# EAGLE design slaveMeteo (EAGLE 8.2.2)

## Sheet 1 of 2
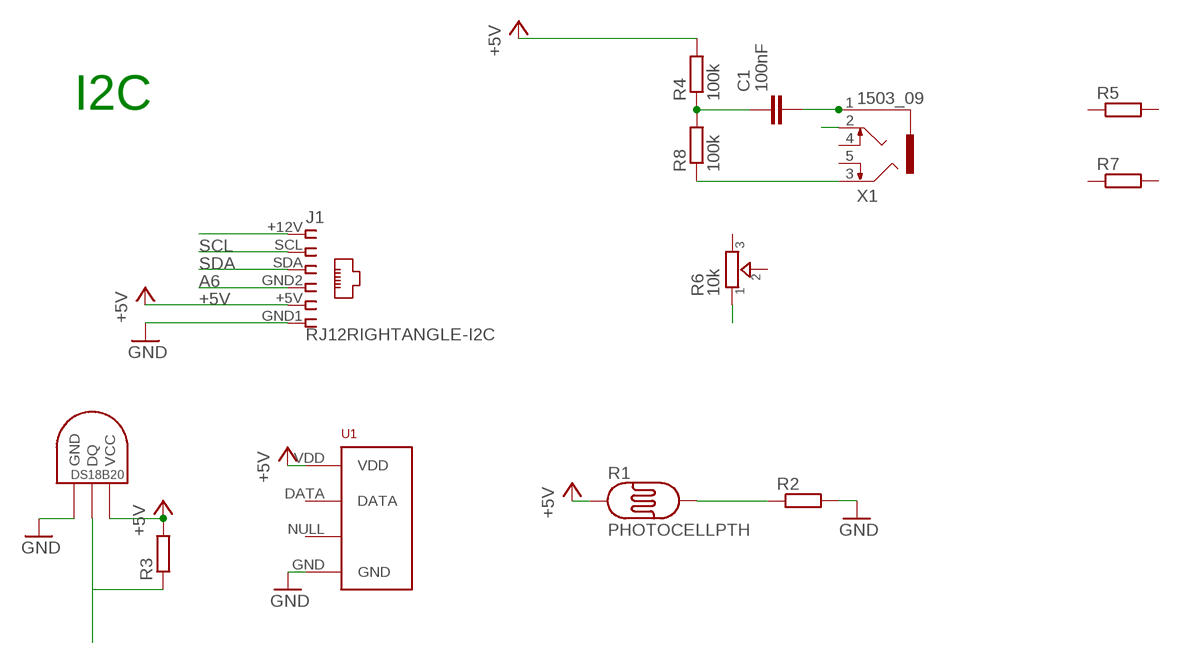
[diagram p0: schematic, sheet 1]

### Parts
C1  100nF  CAPACITOR_NPOL-0805  [C805]
J1  RJ12RIGHTANGLE-I2C  [RJ12-RIGHTANGLE-I2C]
R1  PHOTOCELLPTH  [PHOTOCELL]
R2  R-EU_R0805  [R0805]
R3  R-EU_R0805  [R0805]
R4  100k  R-EU_R0805  [R0805]
R5  R-EU_R0805  [R0805]
R6  10k  TRIMMER-3362P  [TRIMMER_3362P]
R7  R-EU_R0805  [R0805]
R8  100k  R-EU_R0805  [R0805]
U1  RHT03_DHT-22_AM2302RA  [RHT03_DHT-22/RA]
U$1  DS1820TO92  [DS1820]
X1  1503_09  [1503_09]

### Nets
+5V: J1.+5V R1.1 R3.2 R4.2 U1.VDD U$1.VDD(VCC)
A6: J1.GND2
GND [power]: J1.GND1 R2.2 U1.GND U$1.GND ; also sheet 2
GND1 [power]: R6.1
GND2 [power]: R8.1 X1.3
N$1: R1.2 R2.1
N$3: R3.1 U$1.DQ
N$4: J1.+12V
N$5: C1.1 R4.1 R8.2
N$14 [power]: C1.2 X1.1
N$21 [power]: X1.2
SCL: J1.SCL
SDA: J1.SDA
Unconnected: R5.1 R5.2 R6.2 R6.3 R7.1 R7.2 U1.DATA U1.NULL X1.4 X1.5

### Notes on the sheet
- I2C

## Sheet 2 of 2
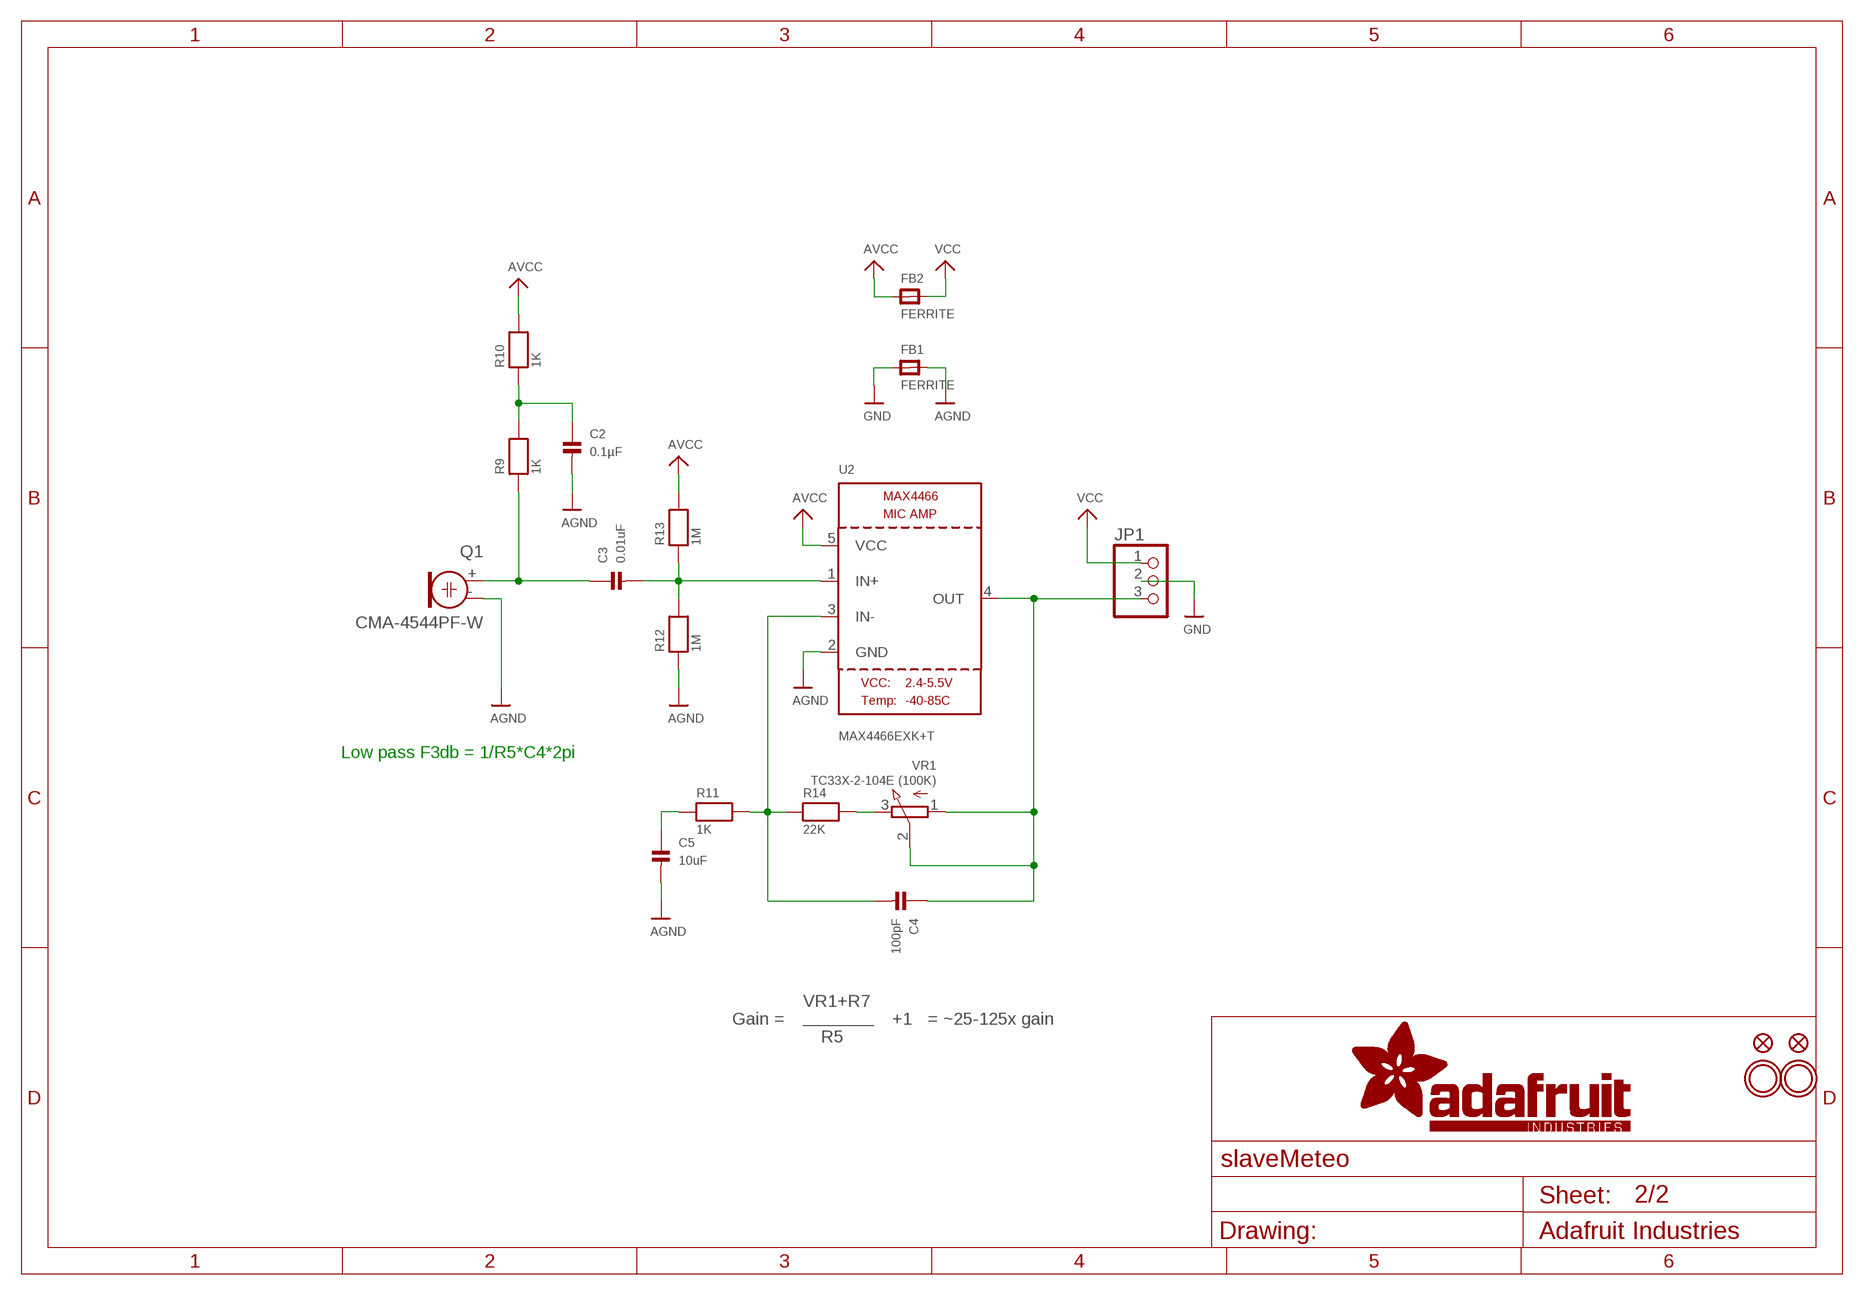
[diagram p1: schematic, sheet 2]

### Parts
C2  0.1µF  CAP_CERAMIC0805  [0805]
C3  0.01uF  CAP_CERAMIC0805  [0805]
C4  100pF  CAP_CERAMIC0805  [0805]
C5  10uF  CAP_CERAMIC0805  [0805]
FB1  FERRITE  FERRITE0805  [0805]
FB2  FERRITE  FERRITE0805  [0805]
FID1  FIDUCIAL""  [FIDUCIAL_1MM]
FID2  FIDUCIAL""  [FIDUCIAL_1MM]
JP1  HEADER-1X376MIL  [1X03_ROUND_76]
Q1  CMA-4544PF-W  ELECTRET  [ELECTRET_9.7]
R9  1K  RESISTOR0805  [0805]
R10  1K  RESISTOR0805  [0805]
R11  1K  RESISTOR0805  [0805]
R12  1M  RESISTOR0805  [0805]
R13  1M  RESISTOR0805  [0805]
R14  22K  RESISTOR0805  [0805]
U2  MAX4466EXK+T  MAX4466""  [SC70-5]
U$14  MOUNTINGHOLE2.5  [MOUNTINGHOLE_2.5_PLATED]
U$15  MOUNTINGHOLE2.5  [MOUNTINGHOLE_2.5_PLATED]
VR1  TC33X-2-104E (100K)  TRIMPOTTC33X-2  [TRIMPOT_BOURNS_TC33X-2]

### Nets
AGND: C2.2 C5.2 FB1.2 Q1.- R12.1 U2.2(GND)
AVCC: FB2.1 R10.2 R13.2 U2.5(VCC)
GND [power]: FB1.1 JP1.2 ; also sheet 1
N$2: C3.1 Q1.+ R9.1
N$6: C2.1 R9.2 R10.1
N$7: C3.2 R12.2 R13.1 U2.1(IN+)
N$8: C4.1 JP1.3 U2.4(OUT) VR1.1(A) VR1.2(S)
N$9: C4.2 R11.2 R14.1 U2.3(IN-)
N$10: C5.1 R11.1
N$11: R14.2 VR1.3(E)
VCC: FB2.2 JP1.1

### Notes on the sheet
- Low pass F3db = 1/R5*C4*2pi
- VR1+R7
- Gain = | +1 | = ~25-125x gain
- R5

## Library data of the parts
C1 = dp_devices:CAPACITOR_NPOL: Non-Polarized capacitor in various packages
C2-C5 = microbuilder:CAP_CERAMIC: Ceramic Capacitors 0402 - 0402 Surface Mount Capacitors 16pF 50V 5% [Digikey: 445-4899-2-ND] 18pF 50V 5% [Digikey: 490-1281-2-ND] 22pF 50V 5% [Digikey: 490-1283-2-ND] 68pF 50V 5% [Digikey: 490-1289-2-ND] 0.1uF 10V 10% [Digikey: 490-1318-2-ND] 1.0uF 6.3V 10% [Digikey: 490-1320-2-ND] 0603 - 0603 Surface Mount Capacitors 16 pF 50V 5% [Digikey: 445-5051-2-ND] 22 pF 50V [Digikey: PCC220ACVTR-ND] 33 pF 50V 5% [Digikey: 490-1415-1-ND] 56pF 50V 5% [Digikey: 490-1421-1-ND] 220pF 50V 5% [Digikey: 445-1285-1-ND] 680 pF 50V 2200 pF 50V 5% C0G [Digikey: 445-1297-1-ND] 5600 pF 100V 5% X7R [Digikey: 478-3711-1-ND] 0.1 µF 25V 10% [Digikey: PCC2277TR-ND] 0.22 µF 16V 10% X7R [Digikey: 445-1318-1-ND] 1.0 µF 25V 10% [Digikey: 445-5146-2-ND] 0603 - RF Specific 3pF 250V +/-0.1pF RF [Digikey: 712-1347-1-ND] 18 pF 250V 5% [Digikey: 478-3505-1-ND or 712-1322-1-ND] 56 pF 250V 5% C0G RF [Digikey: 490-4867-1-ND] 68 pF 250V RF [Digikey: 490-4868-1-ND] 0805 - 0805 Surface Mount Capacitors 220 pF 250V 2% RF Ceramic Capacitor [Digikey: 712-1398-1-ND] 1000 pF 50V 2% NP0 Ceramic Capacitor [Digikey: 478-3760-1-ND] 0.1 µF 25V 10% Ceramic Capacitor [Digikey: PCC1828TR-ND] 1.0 µF 16V 10% Ceramic Capacitor[Digikey: 490-1691-2-ND] 10.0 µF 10V 10% Ceramic Capacitor[Digikey: 709-1228-1-ND] 10.0 uF 16V 10% Ceramic Capacitor [Digikey: 478-5165-2-ND] 47 uF 6.3V 20% Ceramic Capacitor [Digikey: 587-1779-1-ND or 399-5506-1-ND] 1206 - 1206 Surface Mount Capacitors 47uF 10V 20% Ceramic Capacitor [Digikey: 490-5528-1-ND or 399-5508-1-ND or 445-6010-1-ND] 100uF 6.3V -20%, +80% Y5V Ceramic Capacitor (Digikey: 490-4512-1-ND, Mouser: 81-GRM31CF50J107ZE1L)
FB1 FB2 = microbuilder:FERRITE: Ferrite Bead 0603 MMZ1608B121C - 120 Ohm @ 100MHz, 600mA, 0.15 Ohm DC Resistance - Digikey: 445-2164-1-ND BK1608HW121-T - 120 Ohm, 600mA Ferrite Chip - Digikey: 587-1876-2-ND 0805 HZ0805B272R-10 - 2.7K Ohm @ 100MHz, 200mA, 0.8 Ohm DC Resistance - Digikey: 240-2504-1-ND (see also Murata BLM21BD272SN1L) MMZ2012Y152B - 1.5K Ohm @ 100MHz, 500mA, 0.4 Ohm DC Resistance - Digikey: 445-1560-1-ND - Mainly for high frequency (80-400MHz) MMZ2012R102A - 1K Ohm @ 100MHz, 500mA, 0.3 Ohm DC Resistance - Digikey: 445-1555-2-ND - More general purpose (10-200MHz)
FID1 FID2 = microbuilder:FIDUCIAL: Fiducial Alignment Points Various fiducial points for machine vision alignment.
J1 = lpatiny:RJ12: CORCOM Modular RJ Jacks No Shield Source: www.tycoelectronics.com .. ENG_DS_1654001_1099_RJ_L_0507.pdf
JP1 = microbuilder:HEADER-1X3: PIN HEADER
Q1 = microbuilder:ELECTRET: Electret microphone Thru hole 2.54mm spacing with 9.7mm diameter
R1 = SparkFun:PHOTOCELL: Photocell Also known as a CdS photoresistor. This is a low cost way to detect light levels. Resistance decreases with more incoming light. SparkFun SKU: SEN-09088
R2-R5 R7 R8 = resistor:R-EU_: RESISTOR, European symbol
R6 = dp_devices:TRIMMER: Trimmer resistor
R9-R14 = microbuilder:RESISTOR: Resistors 0402 - 0402 Surface Mount Package 22 Ohm 1% 1/16W [Digikey: 311-22.0LRTR-ND] 33 Ohm 5% 1/16W 1.0K 5% 1/16W 1.5K 5% 1/16W 2.0K 1% 1/16W 10.0K 1% 1/16W [Digikey: 311-10.0KLRTR-ND] 10.0K 5% 1/16W [Digikey: RMCF0402JT10K0TR-ND] 12.1K 1% 1/16W [Digikey: 311-22.0LRTR-ND] 100.0K 5% 1/16W 0603 - 0603 Surface Mount Package 0 Ohm 1/10 Watt 1% Resistor 15 Ohm 1/10 Watt 1% Resistor 33 Ohm 1/10 Watt 1% Resistor 49.9 Ohm 1/10 Watt 1% Resistor 100 Ohm 1/10 Watt 1% Resistor 150 Ohm 1/10 Watt 1% Resistor 240 Ohm 1/10 Watt 1% Resistor 390 Ohm 1/10 Watt 1% Resistor 560 Ohm 1/10 Watt 1% Resistor 680 Ohm 1/10 Watt 1% Resistor 750 Ohm 1/10 Watt 1% Resistor 1.0K Ohm 1/10 Watt 1% Resistor 1.5K Ohm 1/10 Watt 1% Resistor 2.0K Ohm 1/10 Watt 1% Resistor 2.2K Ohm 1/10 Watt 1% Resistor 3.3K Ohm 1/10 Watt 1% Resistor 4.7K Ohm 1/10 Watt 1% Resistor 10.0K Ohm 1/10 Watt 1% Resistor 12.0K Ohm 1/10 Watt 1% Resistor 12.1K Ohm 1/10 Watt 1% Resistor 20.0K Ohm 1/10 Watt 1% Resistor 33.0K Ohm 1/10 Watt 1% Resistor 100.0K Ohm 1/10 Watt 1% Resistor 0805 - 0805 Surface Mount Package 0 Ohm 1/8 Watt 1% Resistor 33 Ohm 1/8 Watt 1% Resistor 100 Ohm 1/8 Watt 1% Resistor 150 Ohm 1/8 Watt 1% Resistor 200 Ohm 1/8 Watt 1% Resistor 240 Ohm 1/8 Watt 1% Resistor 330 Ohm 1/8 Watt 1% Resistor 390 Ohm 1/8 Watt 1% Resistor 470 Ohm 1/8 Watt 1% Resistor 1.0K Ohm 1/8 Watt 1% Resistor 1.5K Ohm 1/8 Watt 1% Resistor 2.0K Ohm 1/8 Watt 1% Resistor 4.7K Ohm 1/8 Watt 1% Resistor 5.1K Ohm 1/8 Watt 1% Resistor 5.6K Ohm 1/8 Watt 1% Resistor 10.0K Ohm 1/8 Watt 1% Resistor 22.0K Ohm 1/8 Watt 1% Resistor 33.0K Ohm 1/8 Watt 1% Resistor 100K Ohm 1/8 Watt 1% Resistor 1206 - 1206 Surface Mount Package 2012 - 2010 Surface Mount Package 0.11 Ohm 1/2 Watt 1% Resistor - Digikey: RHM.11UCT-ND
U1 = RHT03_DHT-22_AM2302:RHT03_DHT-22_AM2302: RHT03 / DHT-22 / AM2302 Packages and symbol for the RHT03 / DHT-22 relative humidity and temperature sensor. Note: The AM2302 is a wired version of the DHT-22 which typically requires less clearance and is thus provided as a separate package.; PROD_ID: SEN-10167
U2 = microbuilder:MAX4466: MAX4466 - Microphone Pre-Amp
U$1 = Ava:DS1820: DS18B20 Programmable Resolution 1-Wire Digital Thermometer Description The DS18B20 digital thermometer provides 9-bit to 12-bit Celsius temperature measurements and has an alarm function with nonvolatile user-programmable upper and lower trigger points. The DS18B20 communicates over a 1-Wire® bus that by definition requires only one data line (and ground) for communication with a central microprocessor. It has an operating temperature range of -55°C to +125°C and is accurate to ±0.5°C over the range of -10°C to +85°C. In addition, the DS18B20 can derive power directly from the data line ("parasite power"), eliminating the need for an external power supply. Each DS18B20 has a unique 64-bit serial code, which allows multiple DS18B20s to function on the same 1-Wire bus. Thus, it is simple to use one microprocessor to control many DS18B20s distributed over a large area. Applications that can benefit from this feature include HVAC environmental controls, temperature monitoring systems inside buildings, equipment, or machinery, and process monitoring and control systems.
U$14 U$15 = microbuilder:MOUNTINGHOLE: Mounting Hole For #2 screws (0.086"/2.18mm width, 0.094"/2.4mm hole) use 2.5mm
VR1 = microbuilder:TRIMPOT: 3-Pin SMT Trimpots Bourns TC33 (X-2) Series 10K - Digikey: TC33X-2-103E 100K - Digikey: TC33X-104ECT-ND Bourns 3303 (W) Series 3mm 10K Single Turn - Digikey: 3303W-103ETR-ND 3mm 100K Single Turn - Digikey: 3303X-104ETR-ND
X1 = con-lumberg:1503_09: Jack connectors according to JISC 6560, 3.5 mm Klinkeneinbaukupplung nach JISC 6560, 3,5 mm, 3-polig/ stereo, abgewinkelte Ausführung, mit 2 Öffnern und Lötaugen, für Leiterplatten Rückseitenmontage Source: http://www.lumberg.com/Produkte/PDFs/1503_09.pdf; OC_FARNELL: 1243244; OC_NEWARK: unknown

## Net classes
1 power: width 0.203 mm, drill 0.305 mm, clearance 0.25 mm

## Board
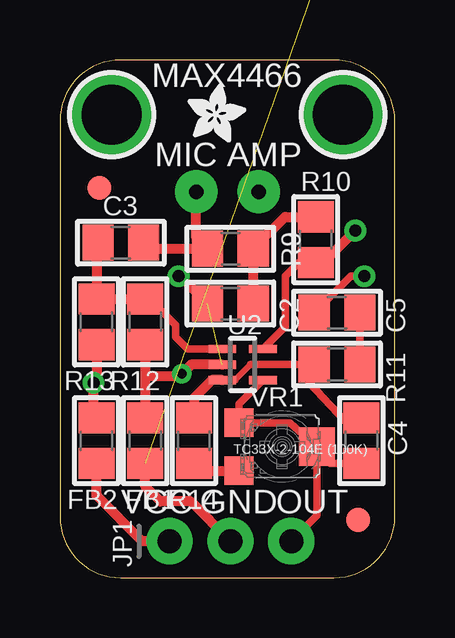
[diagram p2: board, top side]
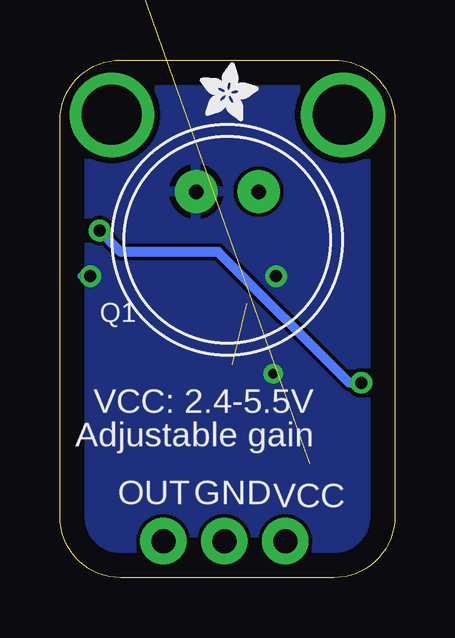
[diagram p3: board, bottom side, seen from below]

Size 13.97 x 21.59 mm. Coordinates in mm from the lower left corner, seen from the top.
Outline: 0,19.05 0,2.54 arc90 2.54,0 11.43,0 arc90 13.97,2.54 13.97,19.05 arc90 11.43,21.59 2.54,21.59 arc90 0,19.05
Copper layers (1*16): Top 0.035mm / dielectric 1.5mm / Bottom 0.035mm
Design rules "default": minimum track width 6mil, minimum drill 0.35mm, track to track 6mil, track to pad 6mil, pad to pad 6mil, via to via 6mil, smd to smd 6mil, copper to edge 40mil, drill to drill 6mil, minimum pad ring 10mil, minimum via ring 8mil, stop-mask expansion 4mil, vias tented up to drill 0mil, thermal gap 10mil

### Footprints (pad centres in the part's own frame; a part is rotated, then mirrored left to right if it is on the bottom)
C805 = smd 1.3 x 1.5: 1 -0.95,0; 2 0.95,0
0805 = smd 1.3 x 1.5: 1 -0.95,0; 2 0.95,0
FIDUCIAL_1MM = smd 1 x 1: 1 0,0
RJ12-RIGHTANGLE-I2C = drill 0.8 pad 1.3: +5V -1.54,4.84; +12V 2.54,4.84; GND1 -2.54,2.3; GND2 -0.5,2.3; SCL 1.54,2.3; SDA 0.5,4.84 | hole 2.36: -6,0; 6,0
1X03_ROUND_76 = drill 1 pad 1.93: 1 -2.54,0; 2 0,0; 3 2.54,0
ELECTRET_9.7 = drill 0.6 pad 1.778: + 1.3,2; - -1.3,2
PHOTOCELL = drill 0.8 pad 1.676: 1 -2,0; 2 2,0
R0805 = smd 1.3 x 1.5: 1 -0.95,0; 2 0.95,0
TRIMMER_3362P = drill 0.8: 1 -2.54,-0.31; 2 0,2.54; 3 2.54,-0.31
RHT03_DHT-22/RA = drill 0.8: DATA -1.27,0; GND 3.81,0; NULL 1.27,0 | drill 0.8 octagon: VDD -3.81,0 | hole 3.25: 0,24.5
SC70-5 = smd 0.35 x 1.15: 1 -0.65,-0.85; 2 0,-0.85; 3 0.65,-0.85; 4 0.65,0.85; 5 -0.65,0.85
DS1820 = drill 0.8: DQ 2.54,-1.27; GND 0.635,-1.27; VDD 4.445,-1.27
MOUNTINGHOLE_2.5_PLATED = drill 2.5 pad 3.2: P$1 0,0
TRIMPOT_BOURNS_TC33X-2 = smd 1.2 x 1.2: 1 -1,-1.8; 3 1,-1.8 | smd 1.6 x 1.5: 2 0,1.45
1503_09 = drill 0.8 pad 1.2 long: 1 0,-2.1; 2 -4.55,-5.4; 3 5.05,-9.9; 4 -4,-13.1; 5 2.65,-8.5

### Placement (x,y rotation side)
C1  2.54,50.8 0 top  (outside the outline)
C2  7.11,11.43 180 top
C3  2.54,13.97 180 top
C4  12.57,5.72 90 top
C5  11.56,11.05 180 top
FB1  3.56,5.72 90 top
FB2  1.52,5.72 270 top
FID1  12.45,2.41 0 top
FID2  1.65,16.26 0 top
J1  38.1,184.15 0 top  (outside the outline)
JP1  7.11,1.52 0 top
Q1  6.98,14.1 0 bottom
R1  11.43,128.27 0 top  (outside the outline)
R2  39.69,109.22 0 top  (outside the outline)
R3  2.54,102.87 0 top  (outside the outline)
R4  2.54,44.45 0 top  (outside the outline)
R5  2.54,38.1 0 top  (outside the outline)
R6  8.89,90.17 0 top  (outside the outline)
R7  2.54,31.75 0 top  (outside the outline)
R8  2.54,25.4 0 top  (outside the outline)
R9  7.11,13.72 0 top
R10  10.67,14.1 270 top
R11  11.56,8.89 180 top
R12  3.56,10.67 90 top
R13  1.52,10.67 270 top
R14  5.59,5.72 270 top
U1  10.16,143.51 0 top  (outside the outline)
U2  7.62,8.89 270 top
U$1  26.67,144.78 0 top  (outside the outline)
U$14  2.16,19.3 0 top
U$15  11.81,19.3 0 top
U$17  [ADAFRUIT_2.5MM]  5.33,18.16 0 top
U$18  [ADAFRUIT_2.5MM]  8.13,19.05 0 bottom
VR1  9.27,5.46 270 top
X1  11.43,73.66 0 top  (outside the outline)

### Tracks (layer width: path | path; a pad name or v marks a point on that pad's centre or on a via)
+5V  (5 unrouted)
AGND  (via drill 0.4, 0.5)  (1 unrouted)
  Top 0.305: C5.2 12.13,12.57 v12.7,12.57
  Top 0.406: 3.81,6.66 FB1.2 3.56,8.38 | U2.2 5.46,8.89 v5.08,8.51 4.95,8.38 3.56,8.38 | C2.2 5.02,12.57 v4.95,12.57 | R12.1 3.56,8.38
  Bottom 0.305: v12.7,12.57 13.08,12.57
  Bottom 0.406: v4.95,12.57 4.95,12.83
  pour Bottom: 0,21.59 13.97,21.59 13.97,0 0.13,-0.25
AVCC  (via drill 0.5)
  Top 0.305: U2.5 9.4,10.47 9.4,12.57 9.97,13.15 R10.2
  Top 0.406: R13.2 1.52,8.25 v1.4,8.13 1.4,6.41 FB2.1 | v12.32,14.48 10.99,13.15 R10.2
  Bottom 0.406: v1.4,8.13 1.91,8.13 7.37,13.59 11.43,13.59 v12.32,14.48
GND  (4 unrouted)
  Top 0.406: JP1.2 5.46,3.18 4.19,3.18 3.56,3.81 FB1.1
GND2  (1 unrouted)
N$1  (1 unrouted)
N$2
  Top 0.406: Q1.+ 5.69,14.19 R9.1 3.74,13.72 C3.1
N$3  (1 unrouted)
N$5  (2 unrouted)
N$6
  Top 0.406: C2.1 R9.2 9.39,15.05 R10.1
N$7
  Top 0.305: 4,11.62 R12.2 3.75,11.62 4.83,10.54 4.83,10.03 5.32,9.54 U2.1
  Top 0.406: R12.2 R13.1 1.52,13.9 C3.2
N$8
  Top 0.305: U2.4 7.47,7.24 VR1.1 9.59,6.46 VR1.2 | VR1.2 11.29,4.77 C4.1 | JP1.3 10.72,2.59 VR1.2
N$9
  Top 0.254: 7.3,8.24 7.95,8.89
  Top 0.305: U2.3 7.3,8.24 | 7.95,8.89 R11.2 | C4.2 11.88,6.54 10.41,8.13 10.41,8.83
  Top 0.406: U2.3 6.34,8.24 5.59,7.49 R14.1 | 10.41,8.83 10.48,8.89 R11.2
N$10
  Top 0.305: C5.1 R11.1
N$11
  Top 0.406: R14.2 5.64,4.46 VR1.3
N$14  (1 unrouted)
VCC
  Top 0.406: JP1.1 3.43,1.52 1.52,3.43 FB2.2

### Text on the board
tPlace: MAX4466 | MIC AMP | VCC | GND | OUT
bPlace: VCC: 2.4-5.5V | Adjustable gain | VCC | GND | OUT